# EAGLE design T61_LC_Scanner (EAGLE 9.2.2)
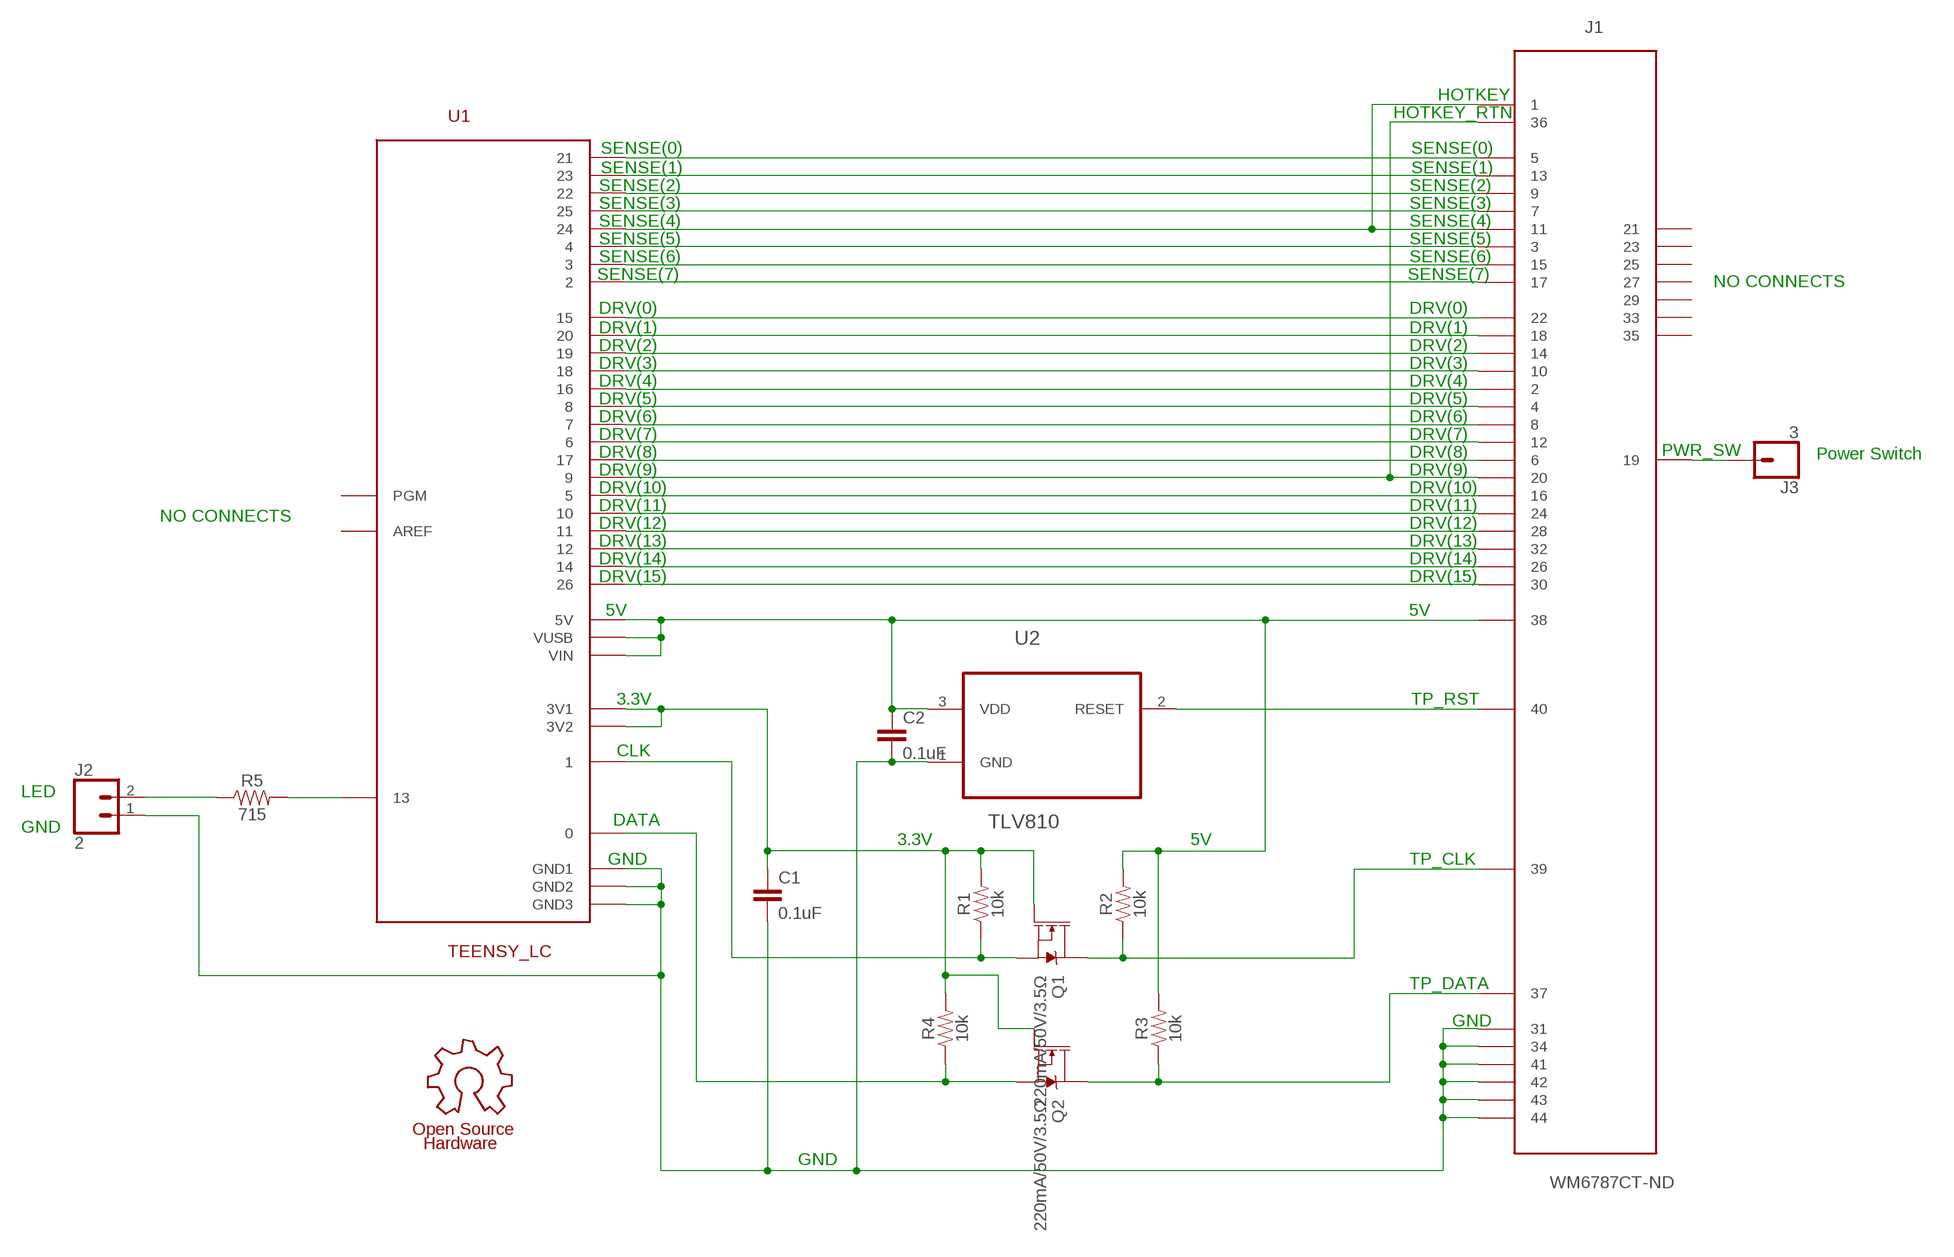
[diagram p0: schematic, sheet 1]

## Parts
C1  0.1uF  0.1UF-0603-25V-(+80/-20%)  [0603]
C2  0.1uF  0.1UF-0603-25V-(+80/-20%)  [0603]
GOLD_ORB_SM1  OSHWLOGOLOGO5MM  [OSHW_5MM]
J1  WM6787CT-ND  [WM6787CT-ND]
J2  2  CONN_02  [1X02]
J3  3  CONN_01  [1X01]
Q1  220mA/50V/3.5Ω  MOSFET-NCH-BSS138  [SOT23-3]
Q2  220mA/50V/3.5Ω  MOSFET-NCH-BSS138  [SOT23-3]
R1  10k  10KOHM-0603-1/10W-1%  [0603]
R2  10k  10KOHM-0603-1/10W-1%  [0603]
R3  10k  10KOHM-0603-1/10W-1%  [0603]
R4  10k  10KOHM-0603-1/10W-1%  [0603]
R5  715  715OHM-0603-1/10W-1%  [0603]
U1  TEENSY_LC  [TEENSY_LC]
U2  TLV810SDBZT  [SOT95P237X112-3N]

## Nets
3V: C1.1 Q1.1(G) Q2.1(G) R1.2 R4.2 U1.3V1 U1.3V2
5V: C2.1 J1.P$38 R2.2 R3.2 U1.5V U1.VIN U1.VUSB U2.3(VDD)
CAPS_LCK: J2.2 R5.1
CLK: Q1.2(S) R1.1 U1.1
DATA: Q2.2(S) R4.1 U1.0
DRV(9): J1.P$20 J1.P$36 U1.9
GND: C1.2 C2.2 J1.P$31 J1.P$34 J1.P$41 J1.P$42 J1.P$43 J1.P$44 J2.1 U1.GND1 U1.GND2 U1.GND3 U2.1(GND)
LED_13: R5.2 U1.13
N$1: J1.P$5 U1.21
N$2: J1.P$13 U1.23
N$3: J1.P$9 U1.22
N$4: J1.P$7 U1.25
N$5: J1.P$3 U1.4
N$6: J1.P$15 U1.3
N$7: J1.P$17 U1.2
N$8: J1.P$22 U1.15
N$9: J1.P$18 U1.20
N$10: J1.P$14 U1.19
N$11: J1.P$10 U1.18
N$12: J1.P$2 U1.16
N$13: J1.P$4 U1.8
N$14: J1.P$8 U1.7
N$15: J1.P$12 U1.6
N$16: J1.P$6 U1.17
N$17: J1.P$16 U1.5
N$18: J1.P$24 U1.10
N$19: J1.P$28 U1.11
N$20: J1.P$32 U1.12
N$21: J1.P$26 U1.14
N$22: J1.P$30 U1.26
PWR_SW: J1.P$19 J3.1
SENSE(4): J1.P$1 J1.P$11 U1.24
TP_CLK: J1.P$39 Q1.3(D) R2.1
TP_DATA: J1.P$37 Q2.3(D) R3.1
TP_RST: J1.P$40 U2.2(RESET)
Unconnected: J1.P$21 J1.P$23 J1.P$25 J1.P$27 J1.P$29 J1.P$33 J1.P$35 U1.AREF U1.PGM

## Notes on the sheet
- HOTKEY
- HOTKEY_RTN
- SENSE(0) | SENSE(0)
- SENSE(1) | SENSE(1)
- SENSE(2) | SENSE(2)
- SENSE(3) | SENSE(3)
- SENSE(4) | SENSE(4)
- SENSE(5) | SENSE(5)
- SENSE(6) | SENSE(6)
- SENSE(7) | SENSE(7)
- NO CONNECTS
- DRV(0) | DRV(0)
- DRV(1) | DRV(1)
- DRV(2) | DRV(2)
- DRV(3) | DRV(3)
- DRV(4) | DRV(4)
- DRV(5) | DRV(5)
- DRV(6) | DRV(6)
- DRV(7) | DRV(7)
- DRV(8) | DRV(8) | PWR_SW | Power Switch
- DRV(9) | DRV(9)
- DRV(10) | DRV(10)
- DRV(11) | DRV(11)
- NO CONNECTS
- DRV(12) | DRV(12)
- DRV(13) | DRV(13)
- DRV(14) | DRV(14)
- DRV(15) | DRV(15)
- 5V | 5V
- 3.3V | TP_RST
- CLK
- LED
- DATA
- GND
- 3.3V | 5V
- GND | TP_CLK
- TP_DATA
- GND
- GND

## Library data of the parts
C1 C2 = SparkFun-Capacitors:0.1UF: 0.1µF ceramic capacitors A capacitor is a passive two-terminal electrical component used to store electrical energy temporarily in an electric field.; PROD_ID: CAP-00810
GOLD_ORB_SM1 = oshw:OSHWLOGO: The OSHW logo for PCB layout
J1 = WM6787CT-ND:WM6787CT-ND: WM6787CT-ND - Motherboard keyboard connector Digikey part number WM6787CT-ND Molex part number 0543630489 Technical Specifications: 40 signal pins, odds on top, evens on bottom Pin Pitch is 0.5mm 4 additional ground pins on the corners
J2 = SparkFun-Connectors:CONN_02: Multi connection point. Often used as Generic Header-pin footprint for 0.1 inch spaced/style header connections On any of the 0.1 inch spaced packages, you can populate with these: Break Away Headers - Straight <https://www.sparkfun.com/products/116> (PRT-00116) Break Away Male Headers - Right Angle <https://www.sparkfun.com/products/553> (PRT-00553) Female Headers <https://www.sparkfun.com/products/115> (PRT-00115) Break Away Headers - Machine Pin <https://www.sparkfun.com/products/117> (PRT-00117) Break Away Female Headers - Swiss Machine Pin <https://www.sparkfun.com/products/743> (PRT-00743) For SCREWTERMINALS and SPRING TERMINALS visit here: Screw Terimnals on SparkFun.com <https://www.sparkfun.com/search/results?term=Screw+Terminals> (5mm/3.5mm/2.54mm spacing) This device is also useful as a general connection point to wire up your design to another part of your project. Our various solder wires solder well into these plated through hole pads. Hook-Up Wire - Assortment (Stranded, 22 AWG) <https://www.sparkfun.com/products/11375> (PRT-11375) Hook-Up Wire - Assortment (Solid Core, 22 AWG) <https://www.sparkfun.com/products/11367> (PRT-11367) View the entire wire category on our website here <https://www.sparkfun.com/categories/141> Special notes: Molex polarized connector foot print use with: PRT-08233 with associated crimp pins and housings. 2.54_SCREWTERM for use with PRT-10571. 3.5mm Screw Terminal footprints for PRT-08084 5mm Screw Terminal footprints for use with PRT-08432
J3 = SparkFun-Connectors:CONN_01: Single connection point. Often used as Generic Header-pin footprint for 0.1 inch spaced/style header connections On any of the 0.1 inch spaced packages, you can populate with these: Break Away Headers - Straight <https://www.sparkfun.com/products/116> (PRT-00116) Break Away Male Headers - Right Angle <https://www.sparkfun.com/products/553> (PRT-00553) Female Headers <https://www.sparkfun.com/products/115> (PRT-00115) Break Away Headers - Machine Pin <https://www.sparkfun.com/products/117> (PRT-00117) Break Away Female Headers - Swiss Machine Pin <https://www.sparkfun.com/products/743> (PRT-00743) This device is also useful as a general connection point to wire up your design to another part of your project. Our various solder wires solder well into these plated through hole pads. Hook-Up Wire - Assortment (Stranded, 22 AWG) <https://www.sparkfun.com/products/11375> (PRT-11375) Hook-Up Wire - Assortment (Solid Core, 22 AWG) <https://www.sparkfun.com/products/11367> (PRT-11367) View the entire wire category on our website here <https://www.sparkfun.com/categories/141> Special notes: SMTSO-256-ET is a "flush mount" nut for a 4-40 screw. We mostly use this on specialty testbeds; it is a nice way to connect hardware to your PCB at an adjustable hieght. Also note, the SNAP packages are for using a snappable style connector. We sell a baggie of snaps and they are also used on two LilyPad designs: Snap Assortment - 30 pack (male and female) <https://www.sparkfun.com/products/11347> (DEV-11347) LilyPad Arduino SimpleSnap <https://www.sparkfun.com/products/10941> (DEV-10941) LilyPad SimpleSnap Protoboard <https://www.sparkfun.com/products/10940> (DEV-10940)
Q1 Q2 = SparkFun-DiscreteSemi:MOSFET-NCH: N-channel MOSFETs Voltage controlled devices that allow control of high current outputs. SparkFun Products: SparkFun OpenScale <https://www.sparkfun.com/products/13261> SparkFun Digital Sandbox <https://www.sparkfun.com/products/12651> SparkFun Monster Moto Shield <https://www.sparkfun.com/products/10182> SparkFun MOSFET Power Controller <https://www.sparkfun.com/products/11214>; PROD_ID: TRANS-00830
R1-R4 = SparkFun-Resistors:10KOHM: 10kΩ resistor A resistor is a passive two-terminal electrical component that implements electrical resistance as a circuit element. Resistors act to reduce current flow, and, at the same time, act to lower voltage levels within circuits. - Wikipedia; PROD_ID: RES-00824
R5 = SparkFun-Resistors:715OHM: 715Ω resistor A resistor is a passive two-terminal electrical component that implements electrical resistance as a circuit element. Resistors act to reduce current flow, and, at the same time, act to lower voltage levels within circuits. - Wikipedia; PROD_ID: RES-07850
U1 = Teensy_LC:TEENSY_LC
U2 = TLV810SDBZT:TLV810SDBZT: 3-Pin Voltage Supervisors; AVAILABILITY: Unavailable; DESCRIPTION: 3-Pin Voltage Supervisors with Active-High, Push-Pull Reset 3-SOT-23 -40 to 125; MF: Texas Instruments; MP: TLV810SDBZT; PACKAGE: TO-236 Texas Instruments; PRICE: None

## Board
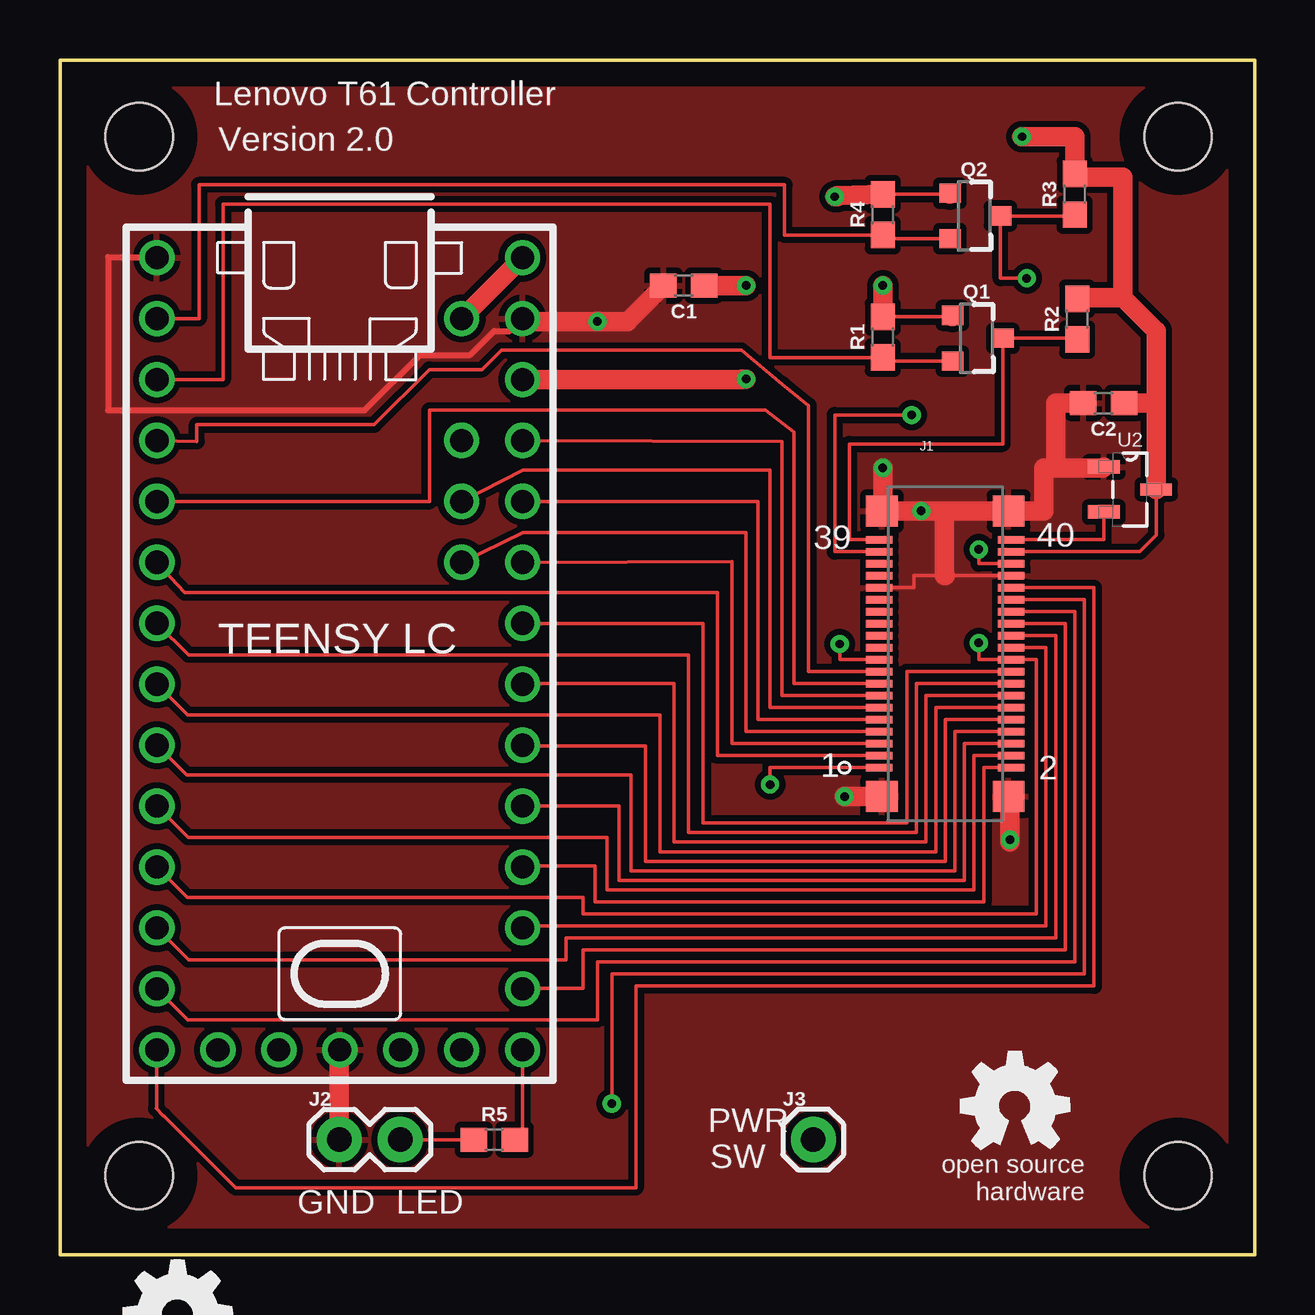
[diagram p1: board, top side]
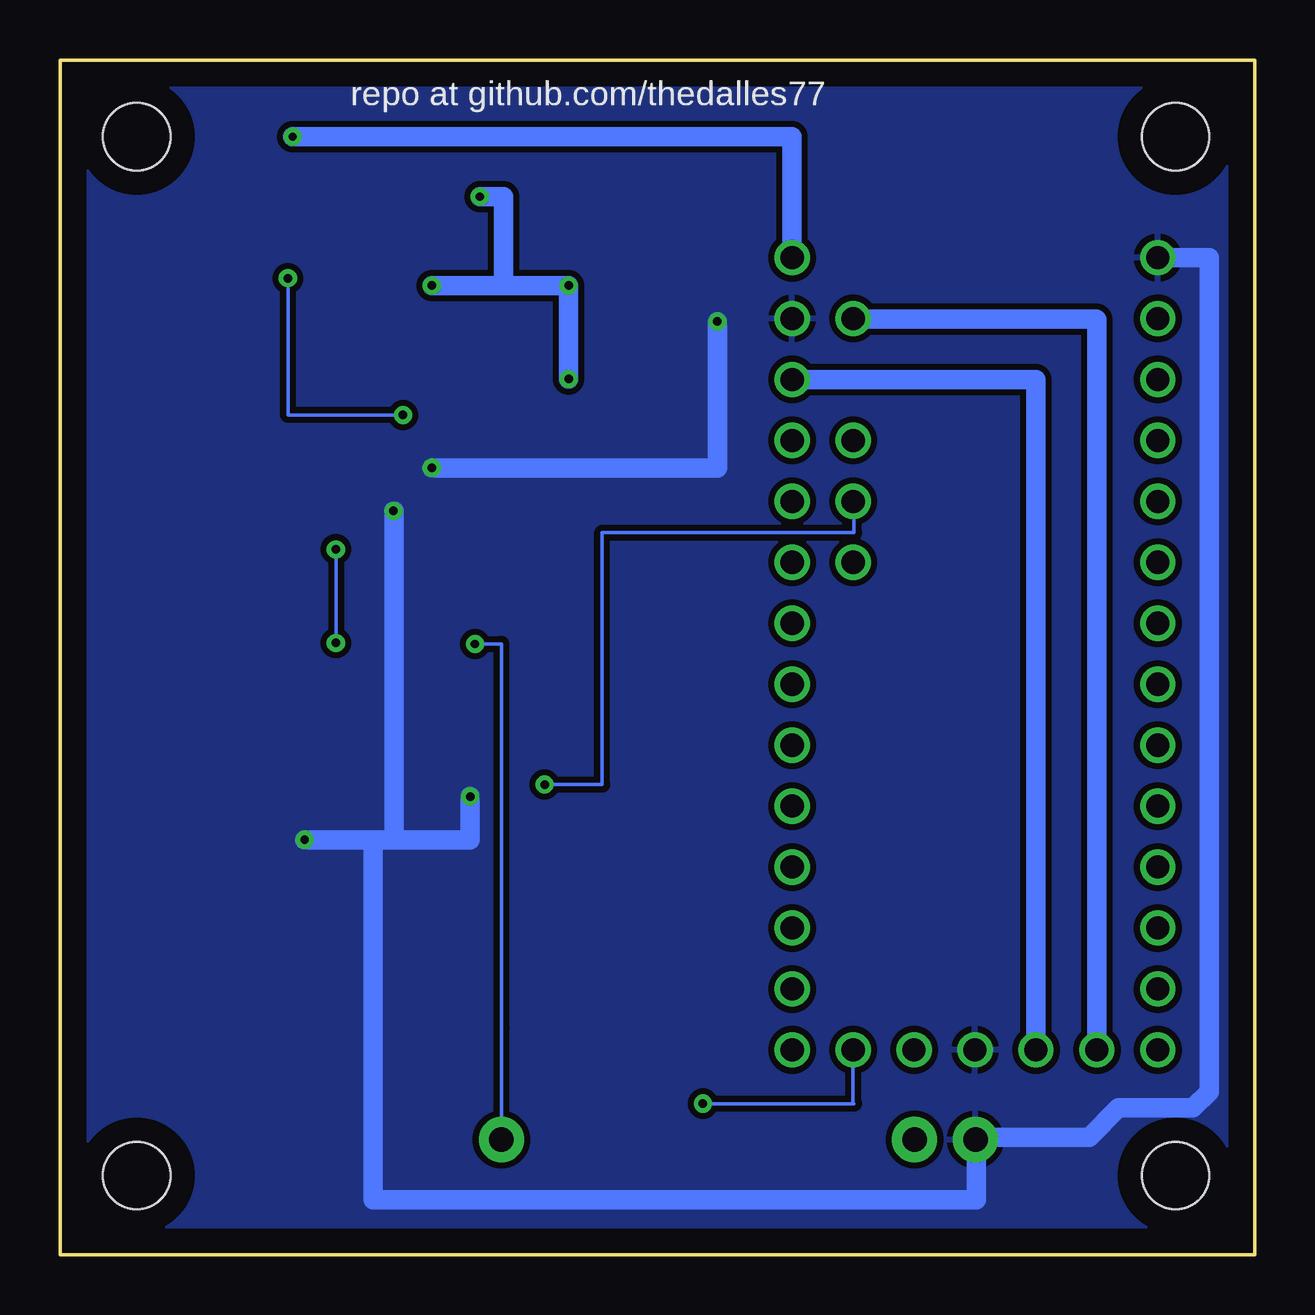
[diagram p2: board, bottom side, seen from below]

Size 49.8 x 49.8 mm. Coordinates in mm from the lower left corner, seen from the top.
Outline: 0,0 0,49.8 49.8,49.8 49.8,0 0,0
Copper layers (1*16): Top 0.035mm / dielectric 1.5mm / Bottom 0.035mm
Design rules "default": minimum track width 6mil, minimum drill 0.35mm, track to track 6mil, track to pad 6mil, pad to pad 6mil, via to via 6mil, smd to smd 6mil, copper to edge 40mil, drill to drill 6mil, minimum pad ring 10mil, minimum via ring 8mil, stop-mask expansion 4mil, vias tented up to drill 0mil, thermal gap 10mil
Holes 2.8 mm at 3.3,3.3 46.6,3.3 46.6,46.6 3.3,46.6

### Footprints (pad centres in the part's own frame; a part is rotated, then mirrored left to right if it is on the bottom)
0603 = smd 1.1 x 1: 1 -0.85,0; 2 0.85,0
WM6787CT-ND = smd 0.3 x 1.1: P$1 -4.7,2.85; P$2 -4.7,-2.65; P$3 -4.2,2.85; P$4 -4.2,-2.65; P$5 -3.7,2.85; P$6 -3.7,-2.65; P$7 -3.2,2.85; P$8 -3.2,-2.65; P$9 -2.7,2.85; P$10 -2.7,-2.65; P$11 -2.2,2.85; P$12 -2.2,-2.65; P$13 -1.7,2.85; P$14 -1.7,-2.65; P$15 -1.2,2.85; P$16 -1.2,-2.65; P$17 -0.7,2.85; P$18 -0.7,-2.65; P$19 -0.2,2.85; P$20 -0.2,-2.65; P$21 0.3,2.85; P$22 0.3,-2.65; P$23 0.8,2.85; P$24 0.8,-2.65; P$25 1.3,2.85; P$26 1.3,-2.65; P$27 1.8,2.85; P$28 1.8,-2.65; P$29 2.3,2.85; P$30 2.3,-2.65; P$31 2.8,2.85; P$32 2.8,-2.65; P$33 3.3,2.85; P$34 3.3,-2.65; P$35 3.8,2.85; P$36 3.8,-2.65; P$37 4.3,2.85; P$38 4.3,-2.65; P$39 4.8,2.85; P$40 4.8,-2.65 | smd 1.3 x 1.32: P$41 -5.9,2.74; P$42 -5.9,-2.54; P$43 6,2.74; P$44 6,-2.54
1X02 = drill 1.016 pad 1.88: 1 0,0; 2 2.54,0
1X01 = drill 1.016 pad 1.88: 1 0,0
SOT23-3 = smd 0.8 x 0.9: 1 -0.95,-1; 2 0.95,-1; 3 0,1.1
TEENSY_LC = drill 0.965: 0 -13.97,-7.62; 1 -11.43,-7.62; 2 -8.89,-7.62; 3 -6.35,-7.62; 3V1 -11.43,7.62; 3V2 16.51,-2.54; 4 -3.81,-7.62; 5 -1.27,-7.62; 5V -16.51,7.62; 6 1.27,-7.62; 7 3.81,-7.62; 8 6.35,-7.62; 9 8.89,-7.62; 10 11.43,-7.62; 11 13.97,-7.62; 12 16.51,-7.62; 13 16.51,7.62; 14 13.97,7.62; 15 11.43,7.62; 16 8.89,7.62; 17 6.35,7.62; 18 3.81,7.62; 19 1.27,7.62; 20 -1.27,7.62; 21 -3.81,7.62; 22 -6.35,7.62; 23 -8.89,7.62; 24 -6.35,5.08; 25 -3.81,5.08; 26 16.51,5.08; AREF -8.89,5.08; GND1 -16.51,-7.62; GND2 -13.97,7.62; GND3 16.51,0; PGM 16.51,2.54; VIN 16.51,-5.08; VUSB -13.97,5.08
SOT95P237X112-3N = smd 1.321 x 0.559: 1 -1.092,0.94; 2 -1.092,-0.94 | smd 1.321 x 0.508: 3 1.092,0

### Placement (x,y rotation side)
C1  26,40.4 180 top
C2  43.5,35.5 180 top
GOLD_ORB_SM1  4.9,-2.5 0 top
J1  37,25 90 top
J2  11.64,4.8 0 top
J3  31.4,4.8 0 top
Q1  38.2,38.2 270 top
Q2  38.1,43.3 270 top
R1  34.3,38.25 90 top
R2  42.4,39 90 top
R3  42.3,44.2 90 top
R4  34.3,43.35 90 top
R5  18.1,4.8 0 top
U1  11.66,25.05 270 top
U2  44.6,31.9 0 top
U$1  [OSHW_5MM]  39.8,6.2 0 top

### Tracks (layer width: path | path; a pad name or v marks a point on that pad's centre or on a via)
3V  (via drill 0.35)
  Top 0.152: R4.2 37.1,44.2 | R1.2 37.2,39.1
  Top 0.813: U1.3V1 28.4,36.48 28.4,36.5 v28.6,36.5 | v28.6,40.4 C1.1 | R4.2 32.4,44.15 32.4,44.1 v32.3,44.1 | v34.3,40.4 R1.2 | 37.1,44.2 Q2.1 | 37.2,39.1 Q1.1
  Bottom 0.813: U1.3V1 9.12,36.48 U1.3V2 | v28.6,36.5 v28.6,40.4 31.3,40.4 | v32.3,44.1 31.3,44.1 31.3,40.4 | v34.3,40.4 31.3,40.4
5V  (via drill 0.35)
  Top 0.152: J1.P$38 45,29.3 45.7,30 U2.3 | 43.3,44.91 42.3,44.91 R3.2
  Top 0.813: U2.3 45.69,35.49 | 45.69,35.49 45.7,35.5 C2.1 | 45.69,35.49 45.69,38.51 44.3,39.9 | 44.3,39.9 42.45,39.9 R2.2 | 44.3,39.9 44.3,44.91 43.3,44.91 42.44,44.91 | v40.1,46.6 42.3,46.6 R3.2 | U1.5V U1.VUSB
  Bottom 0.813: v40.1,46.6 19.3,46.6 19.3,41.58 U1.5V | U1.VIN 6.58,38.98 6.6,39 16.72,39 U1.VUSB
CAPS_LCK
  Top 0.152: J2.2 R5.1
CLK
  Top 0.152: Q1.2 34.4,37.25 R1.1 29.6,37.4 29.6,43.8 6.8,43.8 6.8,36.48 U1.1
DATA
  Top 0.152: Q2.2 34.4,42.35 R4.1 30.2,42.5 30.2,44.6 5.8,44.6 5.8,39.02 U1.0
DRV(9)  (via drill 0.35)
  Top 0.152: U1.9 5.3,14.9 21.8,14.9 21.8,14.2 40.7,14.2 40.7,24.8 J1.P$20 38.3,24.8 v38.3,25.5 | J1.P$36 38.3,28.8 v38.3,29.4
  Bottom 0.152: v38.3,29.4 v38.3,25.5
GND  (via drill 0.35)
  Top 0.152: 11.64,8.52 U1.GND3 | J1.P$31 35.6,27.8 35.6,28.3 36.9,28.3 J1.P$34
  Top 0.254: U1.GND1 2.04,41.56 2,41.6 2,35.2 12.7,35.2 15,37.5 17.1,37.5 18.1,38.5 18.76,38.5 U1.GND2
  Top 0.813: J2.1 11.64,8.52 | J1.P$42 39.6,19.1 v39.6,17.3 39.6,17.2 | J1.P$41 v32.7,19.1 | 36.87,31 v35.9,31 J1.P$43 34.3,31 v34.3,32.8 | 36.87,31 J1.P$44 41,31 41,32.8 41.53,32.8 | 36.9,28.3 36.87,28.3 36.87,31 | U1.GND2 19.4,38.9 v22.4,38.9 23.65,38.9 C1.2 | 41.53,32.8 43.47,32.8 U2.1 | C2.2 41.5,35.5 41.5,32.83 41.53,32.8
  Bottom 0.813: U1.GND1 1.9,41.56 1.9,6.8 2.58,6.12 5.68,6.12 6.9,4.9 11.54,4.9 J2.1 11.6,4.8 11.6,2.3 36.75,2.3 36.75,17.3 | v32.7,19.1 32.7,17.3 35.87,17.3 | 35.87,17.3 36.75,17.3 | 36.75,17.3 v39.6,17.3 | v35.9,31 35.87,31 35.87,17.3 | v34.3,32.8 22.4,32.8 v22.4,38.9
  pour Top (isolate 0.254): 0,0 0,49.8 49.8,49.8 49.8,0
  pour Bottom (isolate 0.254): 0,0 0,49.8 49.8,49.8 49.8,0
LED_13
  Top 0.152: U1.13 19.28,5.13 R5.2
N$1
  Top 0.152: U1.21 28,28.9 28,21.3 J1.P$5
N$2
  Top 0.152: U1.23 30.1,33.9 30.1,23.3 J1.P$13
N$3
  Top 0.152: U1.22 29.1,31.4 29.1,22.3 J1.P$9
N$4
  Top 0.152: U1.25 19.3,30.1 28.6,30.1 28.6,21.8 J1.P$7
N$5
  Top 0.152: U1.4 5.2,27.6 27.4,27.6 27.4,20.8 J1.P$3
N$6
  Top 0.152: U1.3 15.4,31.4 15.4,35.2 29.4,35.2 30.6,34.3 30.6,23.8 J1.P$15
N$7
  Top 0.152: U1.2 5.7,33.9 5.7,34.6 13.1,34.6 15.4,36.9 17.6,36.9 18.4,37.7 28.4,37.7 30.1,36.3 31.2,35.4 31.2,24.3 J1.P$17
N$8
  Top 0.152: J1.P$22 41.1,25.3 41.1,13.7 19.28,13.7 U1.15
N$9
  Top 0.152: U1.20 26.8,26.32 26.8,18 35.3,18 35.3,24.3 J1.P$18
N$10
  Top 0.152: J1.P$14 36.1,23.3 36.1,17.2 25.6,17.2 25.6,23.8 19.28,23.8 U1.19
N$11
  Top 0.152: J1.P$10 36.9,22.3 36.9,16.4 24.4,16.4 24.4,21.2 19.28,21.2 U1.18
N$12
  Top 0.152: J1.P$2 38.5,20.3 38.5,14.7 22.3,14.7 22.3,16.2 19.28,16.2 U1.16
N$13
  Top 0.152: J1.P$4 38.1,20.8 38.1,15.2 22.8,15.2 22.8,17.4 5.34,17.4 U1.8
N$14
  Top 0.152: J1.P$8 37.3,21.8 37.3,16 23.8,16 23.8,20 5.28,20 U1.7
N$15
  Top 0.152: J1.P$12 36.5,22.8 36.5,16.8 25,16.8 25,22.5 5.32,22.5 U1.6
N$16
  Top 0.152: J1.P$6 37.7,21.3 37.7,15.6 23.3,15.6 23.3,18.7 U1.17
N$17
  Top 0.152: J1.P$16 35.7,23.8 35.7,17.6 26.2,17.6 26.2,25 5.36,25 U1.5
N$18
  Top 0.152: J1.P$24 41.5,25.8 41.5,13.2 21.1,13.2 21.1,12.3 5.36,12.3 U1.10
N$19
  Top 0.152: J1.P$28 42.3,26.8 42.3,12.2 22.4,12.2 22.4,9.8 5.32,9.8 U1.11
N$20
  Top 0.152: J1.P$32 43.1,27.8 43.1,11.2 24,11.2 24,2.8 7.33,2.8 4.33,5.79 4.31,5.79 4,6.1 4.04,6.1 U1.12
N$21
  Top 0.152: J1.P$26 41.9,26.3 41.9,12.7 21.8,12.7 21.8,11.1 19.28,11.1 U1.14
N$22  (via drill 0.35)
  Top 0.152: J1.P$30 42.7,27.3 42.7,11.7 23,11.7 v23,6.3
  Bottom 0.152: U1.26 16.74,6.34 16.7,6.3 v23,6.3
PWR_SW  (via drill 0.35)
  Top 0.152: J1.P$19 32.5,24.8 v32.5,25.46 32.5,25.5
  Bottom 0.152: v32.5,25.46 31.4,25.46 31.4,9.46 | 31.4,9.46 31.4,9.4 | J3.1 31.4,9.46
SENSE(4)  (via drill 0.35)
  Top 0.152: U1.24 19.3,32.7 29.6,32.7 29.6,22.8 J1.P$11 | J1.P$1 29.6,20.3 v29.6,19.6
  Bottom 0.152: v29.6,19.6 27.2,19.6 27.2,30.1 16.7,30.1 16.7,31.36 U1.24
TP_CLK
  Top 0.152: R2.1 42.35,38.2 Q1.3 39.3,33.8 32.9,33.8 32.9,29.8 J1.P$39
TP_DATA  (via drill 0.35)
  Top 0.152: R3.1 42.25,43.3 Q2.3 39.2,40.7 v40.3,40.7 | J1.P$37 32.3,29.3 32.3,35 v35.5,35
  Bottom 0.152: v35.5,35 40.3,35 v40.3,40.7
TP_RST
  Top 0.152: J1.P$40 43.5,29.8 U2.2

### Text on the board
tPlace: Lenovo T61 Controller | Version 2.0 | 40 | 39 | 1 | 2 | PWR | SW | GND | LED
bPlace: repo at github.com/thedalles77